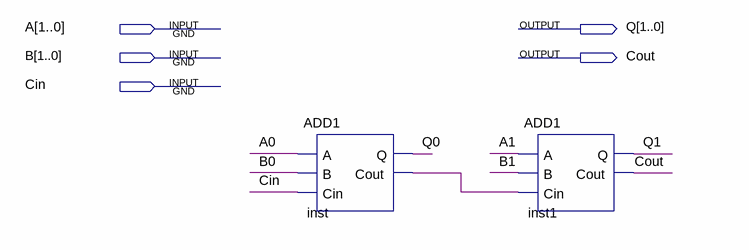
[diagram p0: schematic sheet]
// Quartus schematic ADD2.bdf as structural Verilog: 2 symbols, 5 pins
module ADD2 (
  input  [1:0] A,
  input  [1:0] B,
  input  Cin,
  output [1:0] Q,
  output Cout
);

  wire inst_cout;

  ADD1 inst (.A(A[0]), .B(B[0]), .Cin(Cin), .Q(Q[0]), .Cout(inst_cout));
  ADD1 inst1 (.A(A[1]), .B(B[1]), .Cin(inst_cout), .Q(Q[1]), .Cout(Cout));
endmodule
